# EAGLE design LM3404smallcapandbigcap (EAGLE 6.5.0)
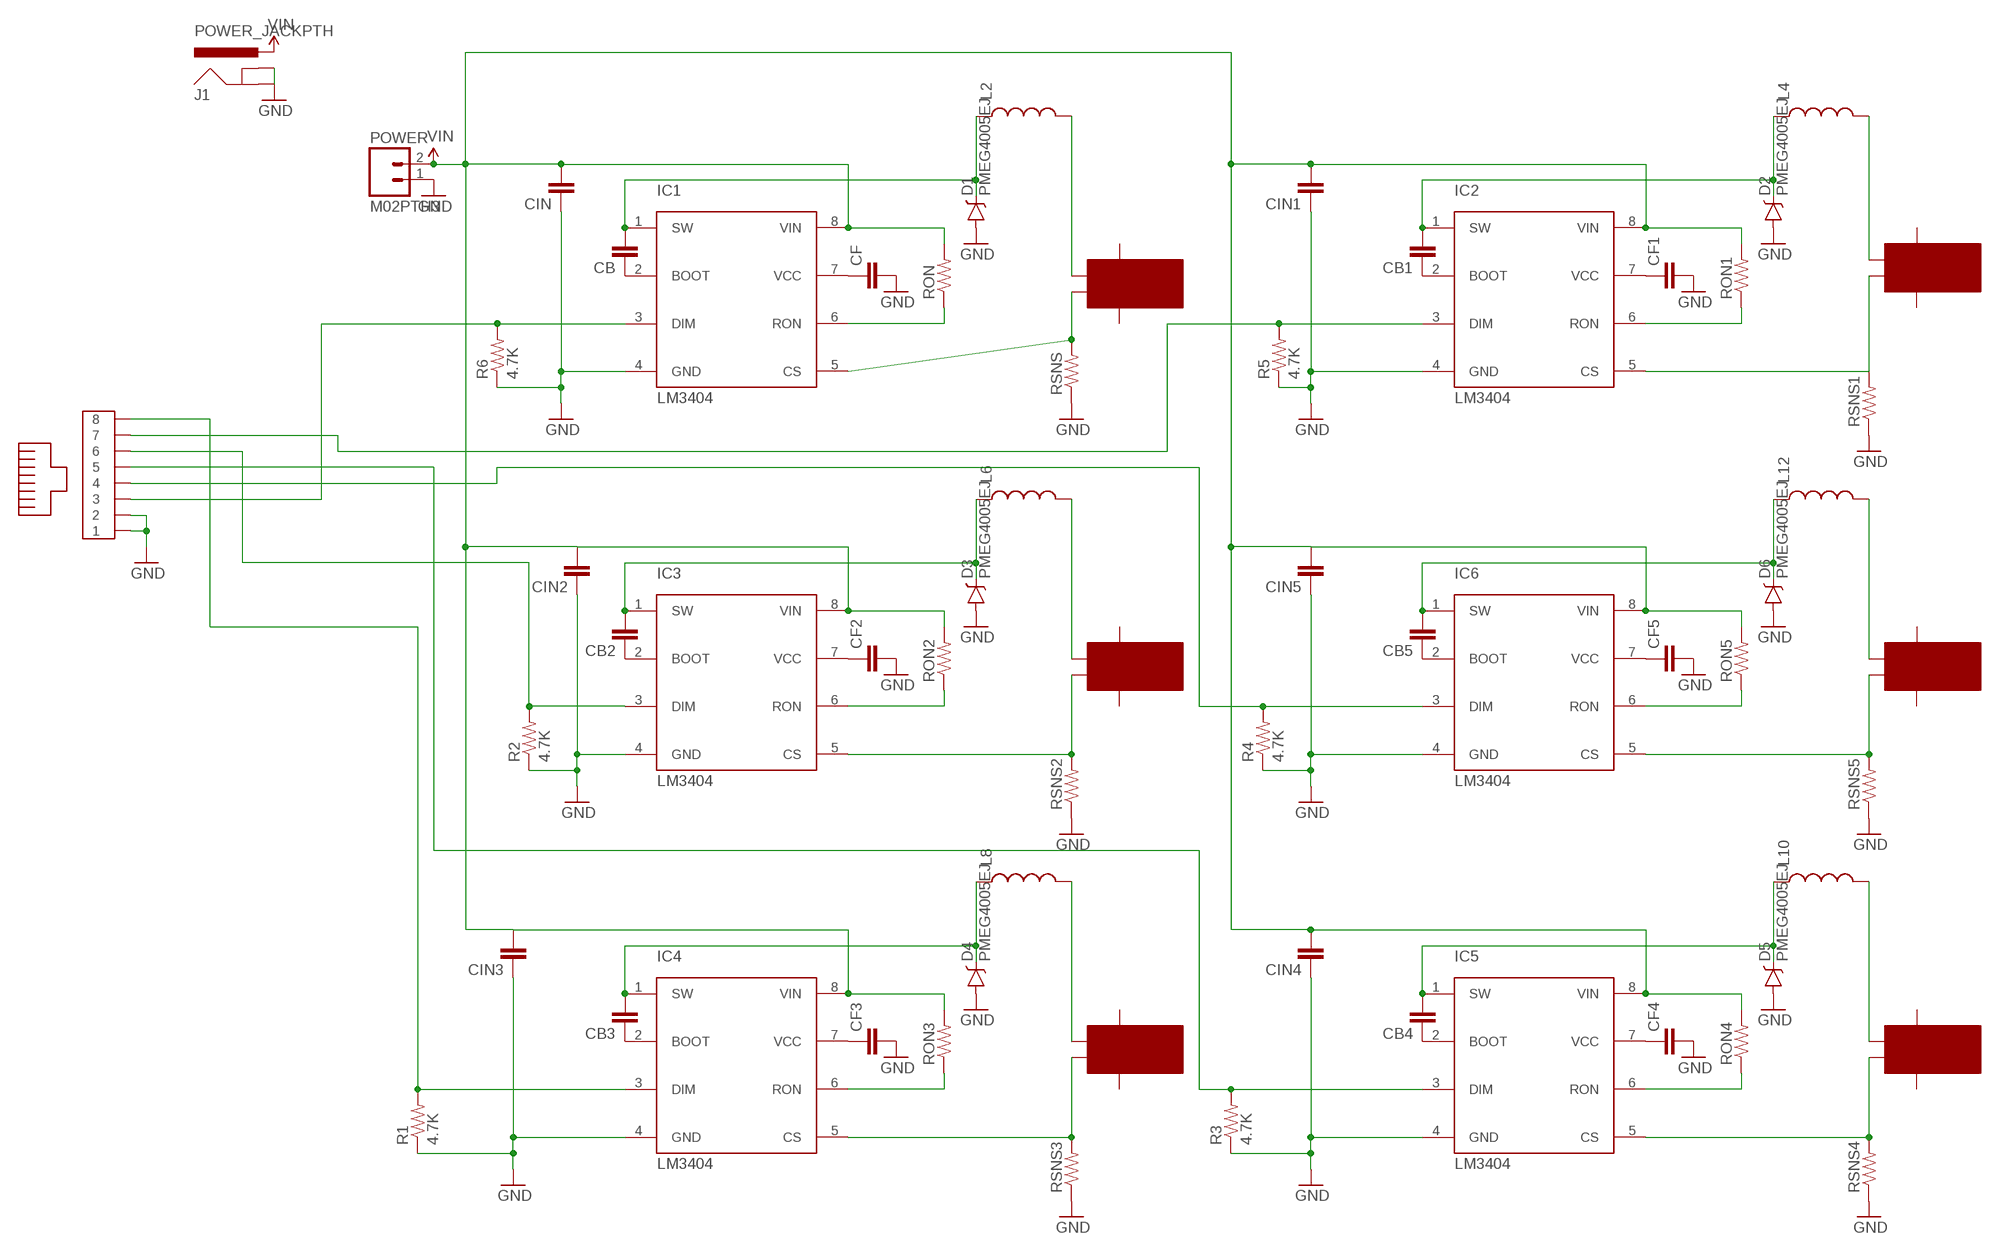
[diagram p0: schematic, sheet 1]

## Parts
CB  CAP0603-CAP  [0603-CAP]
CB1  CAP0603-CAP  [0603-CAP]
CB2  CAP0603-CAP  [0603-CAP]
CB3  CAP0603-CAP  [0603-CAP]
CB4  CAP0603-CAP  [0603-CAP]
CB5  CAP0603-CAP  [0603-CAP]
CF  CAP1206  [1206]
CF1  CAP1206  [1206]
CF2  CAP1206  [1206]
CF3  CAP1206  [1206]
CF4  CAP1206  [1206]
CF5  CAP1206  [1206]
CIN  CAP1210  [1210]
CIN1  CAP1210  [1210]
CIN2  CAP1210  [1210]
CIN3  CAP1210  [1210]
CIN4  CAP1210  [1210]
CIN5  CAP1210  [1210]
D1  PMEG4005EJ  DIODE-SCHOTTKY-PMEG4005EJ  [SOD-323]
D2  PMEG4005EJ  DIODE-SCHOTTKY-PMEG4005EJ  [SOD-323]
D3  PMEG4005EJ  DIODE-SCHOTTKY-PMEG4005EJ  [SOD-323]
D4  PMEG4005EJ  DIODE-SCHOTTKY-PMEG4005EJ  [SOD-323]
D5  PMEG4005EJ  DIODE-SCHOTTKY-PMEG4005EJ  [SOD-323]
D6  PMEG4005EJ  DIODE-SCHOTTKY-PMEG4005EJ  [SOD-323]
IC1  LM3404  [SO8]
IC2  LM3404  [SO8]
IC3  LM3404  [SO8]
IC4  LM3404  [SO8]
IC5  LM3404  [SO8]
IC6  LM3404  [SO8]
J1  POWER_JACKPTH  [POWER_JACK_PTH]
L2  INDUCTORSDR1105  [B82462G]
L4  INDUCTORSDR1105  [B82462G]
L6  INDUCTORSDR1105  [B82462G]
L8  INDUCTORSDR1105  [B82462G]
L10  INDUCTORSDR1105  [B82462G]
L12  INDUCTORSDR1105  [B82462G]
POWER  M02PTH3  [1X02_LONGPADS]
R1  4.7K  RESISTOR1206  [1206]
R2  4.7K  RESISTOR1206  [1206]
R3  4.7K  RESISTOR1206  [1206]
R4  4.7K  RESISTOR1206  [1206]
R5  4.7K  RESISTOR1206  [1206]
R6  4.7K  RESISTOR1206  [1206]
RON  RESISTOR1206  [1206]
RON1  RESISTOR1206  [1206]
RON2  RESISTOR1206  [1206]
RON3  RESISTOR1206  [1206]
RON4  RESISTOR1206  [1206]
RON5  RESISTOR1206  [1206]
RSNS  RESISTOR1206  [1206]
RSNS1  RESISTOR1206  [1206]
RSNS2  RESISTOR1206  [1206]
RSNS3  RESISTOR1206  [1206]
RSNS4  RESISTOR1206  [1206]
RSNS5  RESISTOR1206  [1206]
U$1  MOLEX-RJ45-SMT  [MOLEX-RJ45-SMT]
U$2  RCA_JACK  [RCA_JACK]
U$3  RCA_JACK  [RCA_JACK]
U$4  RCA_JACK  [RCA_JACK]
U$5  RCA_JACK  [RCA_JACK]
U$6  RCA_JACK  [RCA_JACK]
U$7  RCA_JACK  [RCA_JACK]

## Nets
GND: CF1.2 CF2.2 CF3.2 CF4.2 CF5.2 CF.2 CIN1.1 CIN2.1 CIN3.1 CIN4.1 CIN5.1 CIN.1 D1.A D2.A D3.A D4.A D5.A D6.A IC1.4(GND) IC2.4(GND) IC3.4(GND) IC4.4(GND) IC5.4(GND) IC6.4(GND) J1.GND J1.GNDBREAK POWER.1 R1.1 R2.1 R3.1 R4.1 R5.1 R6.1 RSNS1.1 RSNS2.1 RSNS3.1 RSNS4.1 RSNS5.1 RSNS.1 U$1.1 U$1.2
N$1: CF.1 IC1.7(VCC)
N$2: CB.1 IC1.2(BOOT)
N$3: IC2.3(DIM) R5.2 U$1.7
N$4: CB.2 D1.C IC1.1(SW) L2.P$1
N$5: IC1.5(CS) RSNS.2 U$7.INNER
N$6: IC1.6(RON) RON.1
N$7: CF1.1 IC2.7(VCC)
N$8: IC1.3(DIM) R6.2 U$1.3
N$9: L2.P$2 U$7.SIG
N$10: CB1.1 IC2.2(BOOT)
N$11: CB1.2 D2.C IC2.1(SW) L4.P$1
N$12: IC2.6(RON) RON1.1
N$13: IC2.5(CS) RSNS1.2 U$2.INNER
N$14: L4.P$2 U$2.SIG
N$15: IC3.3(DIM) R2.2 U$1.6
N$16: CF2.1 IC3.7(VCC)
N$17: CB2.1 IC3.2(BOOT)
N$18: CB2.2 D3.C IC3.1(SW) L6.P$1
N$19: IC3.6(RON) RON2.1
N$20: IC3.5(CS) RSNS2.2 U$6.INNER
N$21: L6.P$2 U$6.SIG
N$22: IC4.3(DIM) R1.2 U$1.8
N$23: CF3.1 IC4.7(VCC)
N$24: CB3.1 IC4.2(BOOT)
N$25: CB3.2 D4.C IC4.1(SW) L8.P$1
N$26: IC4.6(RON) RON3.1
N$27: IC4.5(CS) RSNS3.2 U$5.INNER
N$28: L8.P$2 U$5.SIG
N$29: IC5.3(DIM) R3.2 U$1.5
N$30: CF4.1 IC5.7(VCC)
N$31: CB4.1 IC5.2(BOOT)
N$32: CB4.2 D5.C IC5.1(SW) L10.P$1
N$33: IC5.6(RON) RON4.1
N$34: IC5.5(CS) RSNS4.2 U$4.INNER
N$35: L10.P$2 U$4.SIG
N$36: IC6.3(DIM) R4.2 U$1.4
N$37: CF5.1 IC6.7(VCC)
N$38: CB5.1 IC6.2(BOOT)
N$39: CB5.2 D6.C IC6.1(SW) L12.P$1
N$40: IC6.6(RON) RON5.1
N$41: IC6.5(CS) RSNS5.2 U$3.INNER
N$42: L12.P$2 U$3.SIG
VIN: CIN1.2 CIN2.2 CIN3.2 CIN4.2 CIN5.2 CIN.2 IC1.8(VIN) IC2.8(VIN) IC3.8(VIN) IC4.8(VIN) IC5.8(VIN) IC6.8(VIN) J1.PWR POWER.2 RON1.2 RON2.2 RON3.2 RON4.2 RON5.2 RON.2
Unconnected: U$2.SWA U$2.SWB U$3.SWA U$3.SWB U$4.SWA U$4.SWB U$5.SWA U$5.SWB U$6.SWA U$6.SWB U$7.SWA U$7.SWB

## Library data of the parts
CB CB1-CB5 CF CF1-CF5 CIN CIN1-CIN5 = SparkFun-Capacitors:CAP: Capacitor Standard 0603 ceramic capacitor, and 0.1" leaded capacitor.
D1-D6 = SparkFun-DiscreteSemi:DIODE-SCHOTTKY: Schottky diodes in SFE's production catalog BAT20J 1A 23V 0.62Vf RB751 120mA 40V 0.37Vf PMEG4005EJ 0.5A 40V 0.42Vf MBRA140 1A 40V 0.5Vf B340A 3A 40V SMA; PROD_ID: DIO-10955
IC1-IC6 = LM3404:LM3404
J1 = SparkFun-Connectors:POWER_JACK: Power Jack This is the standard 5.5mm barrel jack for power. The PTH is the most common, proven, reliable, footprint. The Slot footprint only works if the mill layer is transmitted to the PCB fab house so be warned. Mating wall wart : TOL-00298 (and others); PROD_ID: CONN-08197
L2 L4 L6 L8 L10 L12 = Michael-Passives:INDUCTOR: Inductors Basic Inductor/Choke - 0603 and 1206. Footprints are not proven and vary greatly between part numbers. SRN6045- 33uH, 20% 1.4A SDR0403-560KL - 56uH, 10%, 500mA RMS/740mA peak; TEST: test thsi
POWER = SparkFun-Connectors:M02: Standard 2-pin 0.1" header. Use with - straight break away headers ( PRT-00116) - right angle break away headers (PRT-00553) - swiss pins (PRT-00743) - machine pins (PRT-00117) - female headers (PRT-00115) Molex polarized connector foot print use with: PRT-08233 with associated crimp pins and housings. 2.54_SCREWTERM for use with PRT-10571. 3.5mm Screw Terminal footprints for PRT-08084 5mm Screw Terminal footprints for use with PRT-08432
R1-R6 RON RON1-RON5 RSNS RSNS1-RSNS5 = SparkFun-Resistors:RESISTOR: Resistor Basic schematic elements and footprints for 0603, 1206, and PTH resistors.
U$1 = SMD-RJ45:MOLEX-RJ45-SMT
U$2-U$7 = Michael-Passives:RCA_JACK

## Board
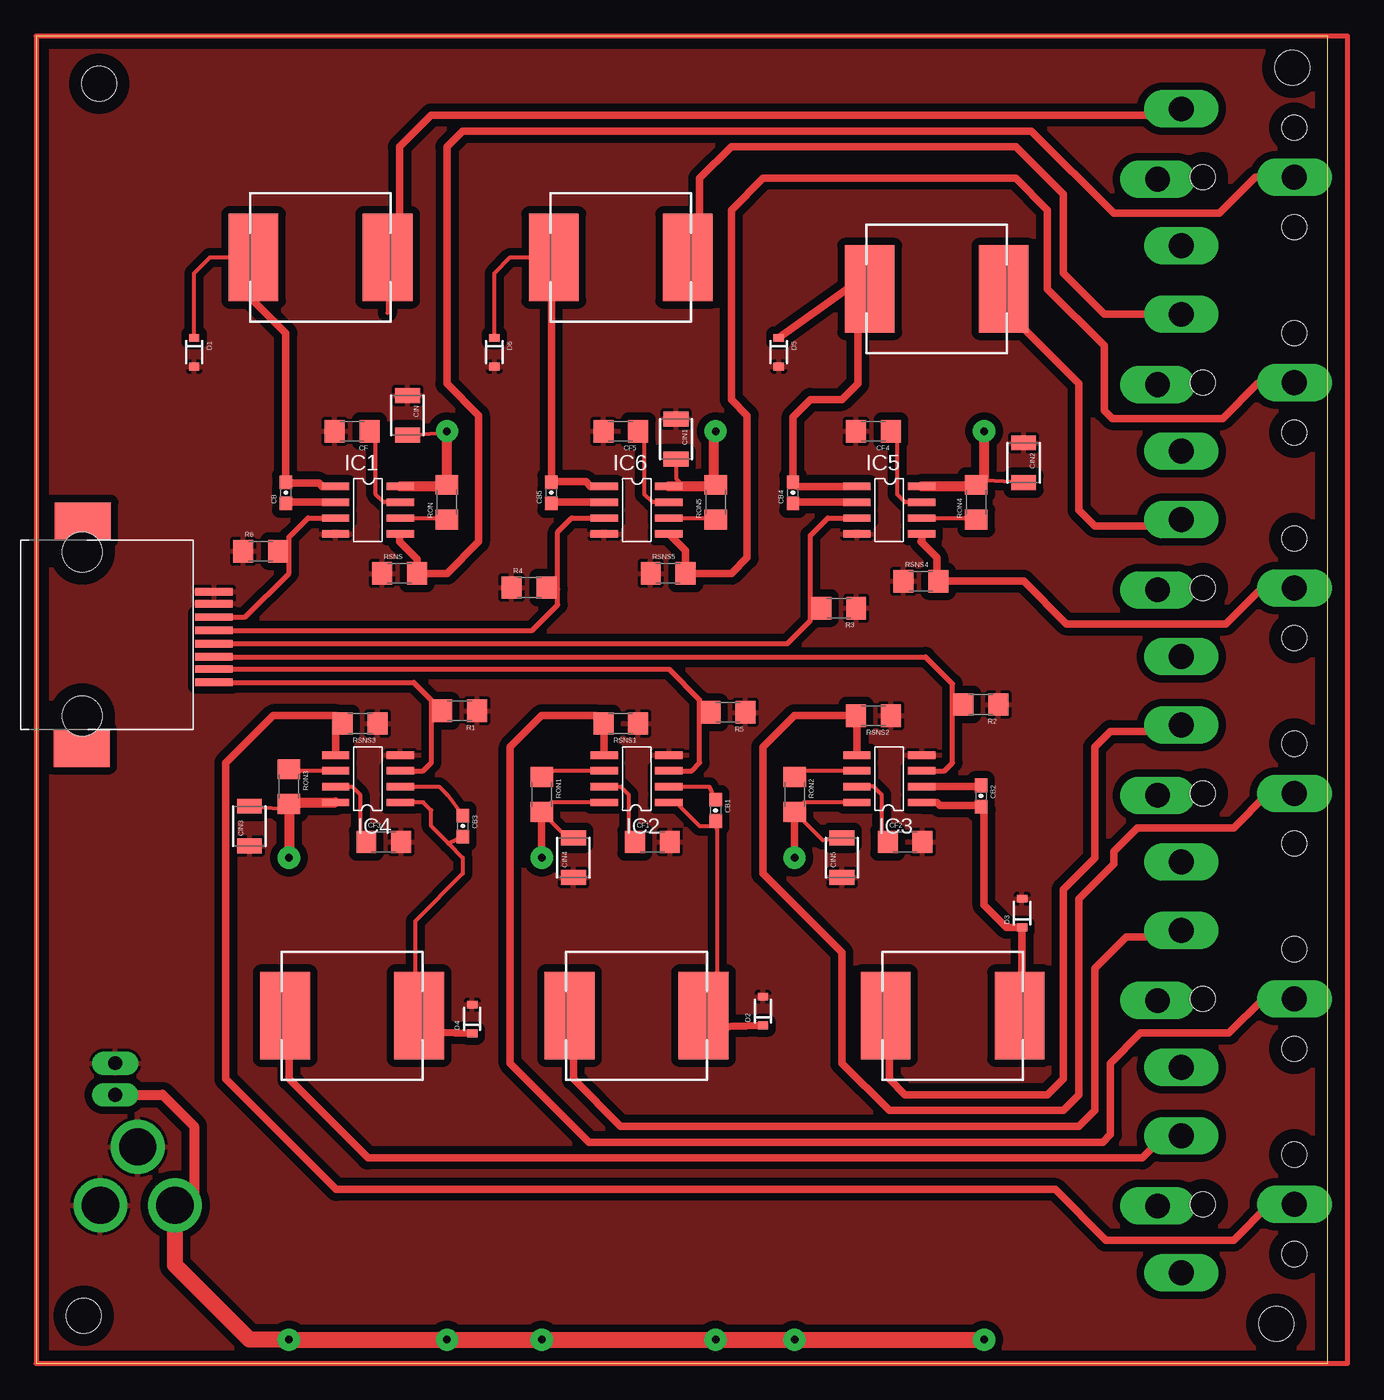
[diagram p1: board, top side]
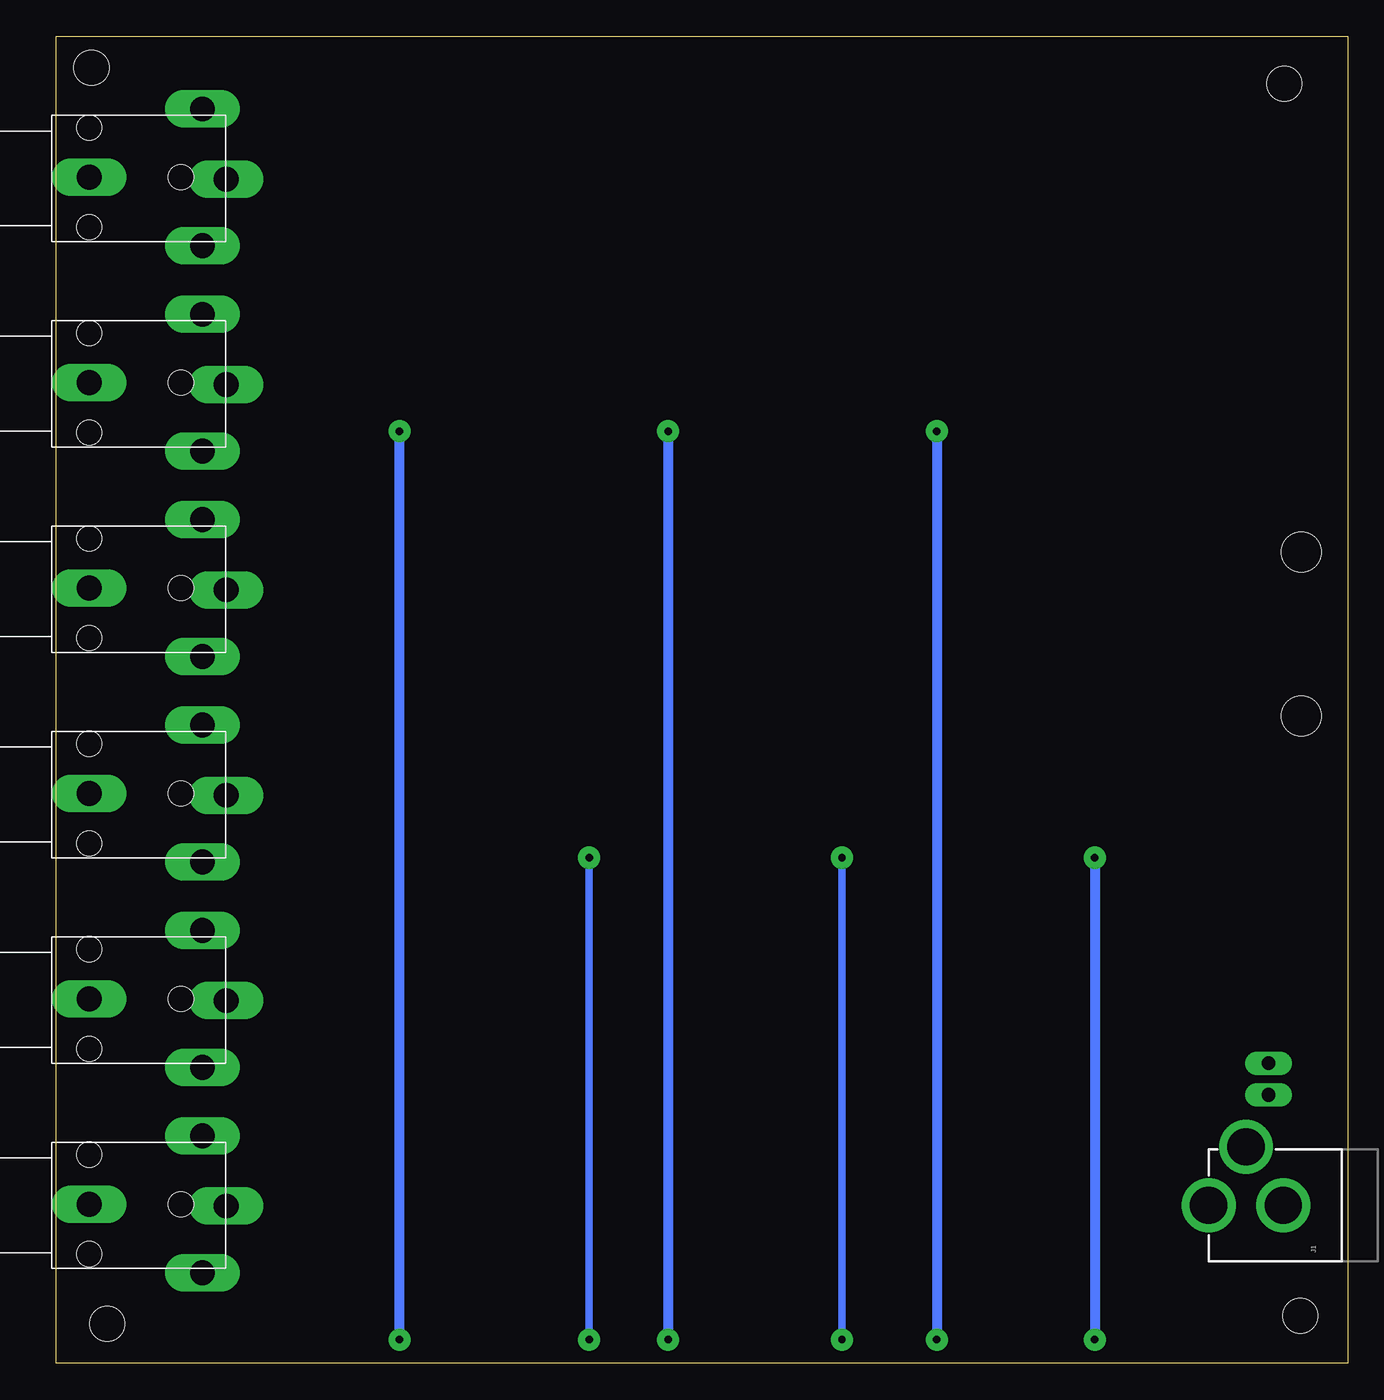
[diagram p2: board, bottom side, seen from below]

Size 103.81 x 106.67 mm. Coordinates in mm from the lower left corner, seen from the top.
Outline: 0,0 103.81,0 103.81,106.67 0,106.67 0,0
Copper layers (1*16): Top 0.035mm / dielectric 1.5mm / Bottom 0.035mm
Design rules "default": minimum track width 10mil, minimum drill 24mil, track to track 8mil, track to pad 8mil, pad to pad 8mil, via to via 8mil, smd to smd 8mil, copper to edge 40mil, drill to drill 8mil, minimum pad ring 10mil, minimum via ring 8mil, stop-mask expansion 4mil, vias tented up to drill 0mil, thermal gap 10mil
Holes 2.8 mm at 5.08,102.87 100.97,104.14 99.69,3.17 3.81,3.81

### Footprints (pad centres in the part's own frame; a part is rotated, then mirrored left to right if it is on the bottom)
0603-CAP = smd 1.1 x 1: 1 -0.85,0; 2 0.85,0
1206 = smd 1.6 x 1.8: 1 -1.4,0; 2 1.4,0
1210 = smd 1.2 x 2: 1 -1.6,0; 2 1.6,0
SOD-323 = smd 0.63 x 0.83: A 1.15,0; C -1.15,0
SO8 = smd 0.6 x 2.2: 1 -1.905,-2.6; 2 -0.635,-2.6; 3 0.635,-2.6; 4 1.905,-2.6; 5 1.905,2.6; 6 0.635,2.6; 7 -0.635,2.6; 8 -1.905,2.6
POWER_JACK_PTH = drill 2.997 pad 4.318: GND 0,7.7; GNDBREAK 4.7,10.7; PWR 0,13.7
B82462G = smd 7.01 x 3.988: P$1 0,5.385; P$2 0,-5.385
1X02_LONGPADS = drill 1.118 pad 1.88 long: 1 0,0; 2 2.54,0
MOLEX-RJ45-SMT = smd 3 x 0.6: 1 10.48,3.61; 2 10.48,2.64; 3 10.48,1.57; 4 10.48,0.5; 5 10.48,-0.57; 6 10.48,-1.64; 7 10.48,-2.61; 8 10.48,-3.68 | smd 4.5 x 3: P$1 -0.16,-8.97; P$2 -0.06,9.28 | hole 3.2: -0.1,6.8; -0.1,-6.4
RCA_JACK = drill 2 long: INNER 5,3; SIG -0.5,12.095; SWA 5.135,14; SWB 10.5,12.095 | hole 2: 1,3; 9,3; 5,10.365

### Placement (x,y rotation side)
CB  20.07,69.98 90 top
CB1  54.61,44.45 270 top
CB2  75.95,45.59 270 top
CB3  34.29,43.18 270 top
CB4  60.83,69.98 90 top
CB5  41.4,69.98 90 top
CF  25.4,74.93 180 top
CF1  49.53,41.91 0 top
CF2  69.85,41.91 0 top
CF3  27.94,41.91 0 top
CF4  67.31,74.93 180 top
CF5  46.99,74.93 180 top
CIN  29.84,76.2 270 top
CIN1  51.44,74.3 270 top
CIN2  79.38,72.39 270 top
CIN3  17.14,43.18 90 top
CIN4  43.18,40.64 90 top
CIN5  64.77,40.64 90 top
D1  12.7,81.28 270 top
D2  58.42,28.32 90 top
D3  79.25,36.2 90 top
D4  35.05,27.69 90 top
D5  59.69,81.28 270 top
D6  36.83,81.28 270 top
IC1  26.67,68.58 270 top
IC2  48.26,46.99 90 top
IC3  68.58,46.99 90 top
IC4  26.67,46.99 90 top
IC5  68.58,68.58 270 top
IC6  48.26,68.58 270 top
J1  -2.54,12.7 90 bottom
L2  22.86,88.9 90 top
L4  48.26,27.94 270 top
L6  73.66,27.94 270 top
L8  25.4,27.94 270 top
L10  72.39,86.36 90 top
L12  46.99,88.9 90 top
POWER  6.35,24.13 270 top
R1  34.04,52.45 180 top
R2  75.95,52.96 180 top
R3  64.52,60.71 180 top
R4  39.62,62.36 0 top
R5  55.63,52.32 180 top
R6  18.03,65.28 0 top
RON  33.02,69.22 90 top
RON1  40.64,45.72 270 top
RON2  60.96,45.72 270 top
RON3  20.32,46.35 270 top
RON4  75.56,69.22 90 top
RON5  54.61,69.22 90 top
RSNS  29.21,63.5 0 top
RSNS1  46.99,51.44 180 top
RSNS2  67.31,52.07 180 top
RSNS3  26.04,51.44 180 top
RSNS4  71.12,62.87 0 top
RSNS5  50.8,63.5 0 top
U$1  3.81,58.42 0 top
U$2  104.14,34.29 270 bottom
U$3  104.14,83.82 270 bottom
U$4  104.14,67.31 270 bottom
U$5  104.14,17.78 270 bottom
U$6  104.14,50.8 270 bottom
U$7  104.14,100.33 270 bottom

### Tracks (layer width: path | path; a pad name or v marks a point on that pad's centre or on a via)
GND
  pour Top (isolate 0.61): 0,106.68 104.14,106.68 104.14,0 0,0
N$1
  Top 0.305: IC1.7 27.94,69.22 27.3,69.85 27.3,74.42 CF.1
N$2
  Top 0.61: IC1.2 20.07,69.22 CB.1
N$3
  Top 0.406: IC2.3 52.7,47.62 53.34,48.26 53.34,52.07 | 53.34,52.07 53.34,53.34 50.87,55.81 U$1.7 | R5.2 53.59,52.32 53.34,52.07
N$4
  Top 0.305: D1.C 12.7,87.63 13.97,88.9 L2.P$1
  Top 0.61: 19.05,87.33 L2.P$1 16.51,87.94 16.51,86.36 20.07,82.8 CB.2 20.15,70.74 22.73,70.74 22.99,70.48 IC1.1
N$5
  Top 0.61: U$7.INNER 100.33,95.33 99.14,95.33 98,95.33 95.12,92.46 86.61,92.46 80.01,99.06 34.29,99.06 33.02,97.79 33.02,78.74 35.56,76.2 35.56,66.04 33.02,63.5 RSNS.2 30.61,64.64 29.21,66.04 29.21,66.61 IC1.5
N$6
  Top 0.305: IC1.6 32.89,67.94 RON.1
N$7
  Top 0.305: IC2.7 46.99,46.35 47.62,45.72 47.62,42.41 CF1.1
N$8
  Top 0.406: 20.32,64.77 20.32,63.5 16.81,59.99 U$1.3 | 20.32,64.77 20.32,66.42 21.84,67.94 IC1.3 | R6.2 19.81,65.28 20.32,64.77
N$9
  Top 0.305: L2.P$2 28.25,84.42
  Top 0.61: L2.P$2 29.21,89.86 29.21,97.79 31.75,100.33 91.55,100.33 U$7.SIG
N$10
  Top 0.305: IC2.2 54.1,46.35 CB1.1 54.61,45.72
N$11
  Top 0.305: 53.34,30.48 53.34,28.25 L4.P$1 54.74,29.04 54.74,42.92 CB1.2 54.48,43.18 53.34,43.18 51.44,45.09 IC2.1
  Top 0.61: D2.C 54.52,27.06 L4.P$1
N$12
  Top 0.305: IC2.6 41.15,47.62 RON1.1
N$13
  Top 0.61: IC2.5 45.66,51.37 RSNS1.2 44.95,52.07 40.64,52.07 38.1,49.53 38.1,24.13 44.45,17.78 85.72,17.78 86.36,18.41 86.36,24.13 88.77,26.54 95.89,26.54 98.63,29.29 U$2.INNER
N$14
  Top 0.61: L4.P$2 43.18,27.64 43.18,22.86 46.99,19.05 83.82,19.05 85.09,20.32 85.09,31.75 87.63,34.29 91.55,34.29 U$2.SIG
N$15
  Top 0.305: 73.66,53.34 74.55,53.34 R2.2
  Top 0.406: IC3.3 73.03,47.62 73.66,48.26 73.66,53.34 73.66,54.61 71.49,56.78 U$1.6
N$16
  Top 0.305: IC3.7 67.31,46.35 67.94,45.72 67.94,42.41 CF2.1
N$17
  Top 0.61: IC3.2 75.86,46.35 CB2.1
N$18
  Top 0.61: IC3.1 72.39,45.09 72.64,44.83 75.86,44.83 CB2.2 76.2,44.49 76.2,36.83 77.98,35.05 D3.C 79.25,28.14 L6.P$1
N$19
  Top 0.305: IC3.6 61.47,47.62 RON2.1
N$20
  Top 0.305: 65.98,52 RSNS2.2
  Top 0.61: 65.98,52 IC3.5 | U$6.INNER 101.06,45.72 100.33,45.72 99.06,45.72 98.93,45.72 96.27,43.05 88.52,43.05 86.61,41.15 86.61,40.13 83.82,37.34 83.82,21.59 82.55,20.32 68.58,20.32 64.77,24.13 64.77,33.02 58.42,39.37 58.42,49.53 60.96,52.07 RSNS2.2
N$21
  Top 0.61: L6.P$2 68.58,27.64 68.58,22.86 69.85,21.59 81.28,21.59 82.55,22.86 82.55,38.1 85.09,40.64 85.09,49.53 86.36,50.8 91.44,50.8 92.71,52.07 92.71,51.97 U$6.SIG
N$22
  Top 0.406: IC4.3 31.11,47.62 31.75,48.26 31.75,52.07 | 31.75,52.07 31.75,53.34 30.35,54.74 U$1.8 | R1.2 32.13,52.45 31.75,52.07
N$23
  Top 0.305: IC4.7 25.4,46.35 26.04,45.72 26.04,42.41 CF3.1
N$24
  Top 0.305: IC4.2 32.38,46.35 33.02,45.72 CB3.1
N$25
  Top 0.305: CB3.2 33.15,41.78 | 33.15,41.78 31.75,43.18 31.75,44.45 31.11,45.09 IC4.1 | L8.P$1 30.48,29.52 30.48,35.56 34.29,39.37 34.29,40.64 33.15,41.78
  Top 0.61: D4.C 32.14,26.59 L8.P$1
N$26
  Top 0.305: IC4.6 20.45,47.62 RON3.1
N$27
  Top 0.305: IC4.5 24.07,50.87 RSNS3.2
  Top 0.61: IC4.5 24.07,52.01 24.13,52.07 19.05,52.07 15.24,48.26 15.24,22.86 24.13,13.97 81.92,13.97 85.98,9.91 96.27,9.91 99.06,12.7 101.06,12.7 U$5.INNER
N$28
  Top 0.305: L8.P$2 20.32,29.52
  Top 0.61: L8.P$2 20.32,27.94 20.32,22.86 26.67,16.51 88.9,16.51 90.17,17.78 91.55,17.78 U$5.SIG
N$29
  Top 0.406: 62.23,60.96 62.23,59.69 60.39,57.85 U$1.5 | 62.23,60.96 62.23,66.55 63.63,67.94 IC5.3 | R3.2 62.48,60.71 62.23,60.96
N$30
  Top 0.305: IC5.7 69.85,69.22 69.22,69.85 69.22,74.42 CF4.1
N$31
  Top 0.61: IC5.2 60.92,69.22 CB4.1
N$32
  Top 0.61: 68.58,83.82 67.31,85.09 67.31,86.06 L10.P$1 | L10.P$1 65.16,86.36 D5.C | IC5.1 61.17,70.48 CB4.2 60.83,76.07 62.23,77.47 64.77,77.47 66.04,78.74 66.04,85.39 L10.P$1
N$33
  Top 0.305: IC5.6 75.44,67.94 RON4.1
N$34
  Top 0.61: 101.06,62.23 U$4.INNER 98.5,62.31 95.63,59.44 82.8,59.44 79.38,62.87 RSNS4.2 72.39,62.99 72.39,64.77 71.12,66.04 71.18,66.1 IC5.5
N$35
  Top 0.305: 76.2,88.9 L10.P$2
  Top 0.61: U$4.SIG 91.55,67.31 85.09,67.31 83.82,68.58 83.82,78.74 78.74,83.82 78.74,85.39 L10.P$2
N$36
  Top 0.406: 41.91,62.23 41.91,60.96 39.87,58.92 U$1.4 | 41.91,62.23 41.91,66.8 43.05,67.94 IC6.3 | R4.2 41.78,62.36 41.91,62.23
N$37
  Top 0.305: IC6.7 49.53,69.22 48.9,69.85 48.9,74.42 CF5.1
N$38
  Top 0.61: IC6.2 41.49,69.22 CB5.1
N$39
  Top 0.305: D6.C 36.83,87.63 38.1,88.9 L12.P$1
  Top 0.61: IC6.1 44.58,70.48 44.2,70.87 41.44,70.87 | 41.44,70.87 CB5.2 | 41.44,70.87 41.44,88.74 L12.P$1
N$40
  Top 0.305: IC6.6 54.48,67.94 RON5.1
N$41
  Top 0.61: U$3.INNER 101.06,78.74 100.58,78.74 99.06,78.74 98.17,78.74 95.38,75.95 86.49,75.95 85.85,76.58 85.85,81.79 81.28,86.36 81.28,92.71 78.74,95.25 58.42,95.25 55.88,92.71 55.88,77.47 57.15,76.2 57.15,64.77 55.88,63.5 RSNS5.2 52.2,65.33 IC6.5
N$42
  Top 0.61: 53.34,87.94 52.86,88.42 | 52.86,88.42 L12.P$2 | 52.86,88.42 53.34,88.9 53.34,95.25 55.88,97.79 78.74,97.79 82.55,93.98 82.55,87.63 85.86,84.32 U$3.SIG
N$43
  Top 0.406: 0,106.68 0,0 105.41,0 105.41,106.68 0,106.68
VIN  (via drill 0.6 pad 1.78)
  Top 0.305: 32.89,70.48 RON.2 | 54.48,70.48 RON5.2 | 75.44,70.48 RON4.2 | IC2.8 41.41,45.09 RON1.2 42.92,42.04 CIN4.2 | IC3.8 61.73,45.09 RON2.2 63.24,42.04 CIN5.2 | CIN.2 32.89,74.8 v33.02,74.93 | CIN1.2 51.44,71.12 52.07,70.48 | CIN2.2 75.44,70.99 74.93,70.48 | CIN3.2 20.19,44.58 20.32,44.45
  Top 0.61: RON1.2 v40.64,40.64 | RON2.2 v60.96,40.64
  Top 0.813: v76.2,74.93 76.2,71.25 RON4.2 | 75.44,70.48 74.93,70.48 IC5.8 | v54.61,74.93 54.48,74.8 54.48,70.48 52.07,70.48 IC6.8 | RON.2 v33.02,74.93 | 32.89,70.48 IC1.8 | v20.32,40.64 20.32,44.45 RON3.2 20.45,45.09 IC4.8 | POWER.2 10.16,21.59 12.7,19.05 12.7,12.7 J1.PWR
  Top 1.27: v76.2,1.91 v60.96,1.91 v54.61,1.91 v40.64,1.91 v33.02,1.91 v20.32,1.91 17.14,1.91 11.16,7.89 J1.PWR
  Bottom 0.61: v40.64,40.64 v40.64,1.91 | v60.96,40.64 v60.96,1.91
  Bottom 0.813: v76.2,1.91 v76.2,74.93 | v54.61,74.93 v54.61,1.91 | v33.02,74.93 v33.02,1.91 | v20.32,40.64 v20.32,1.91